# EAGLE design Battery Board V7 (EAGLE 8.5.0)
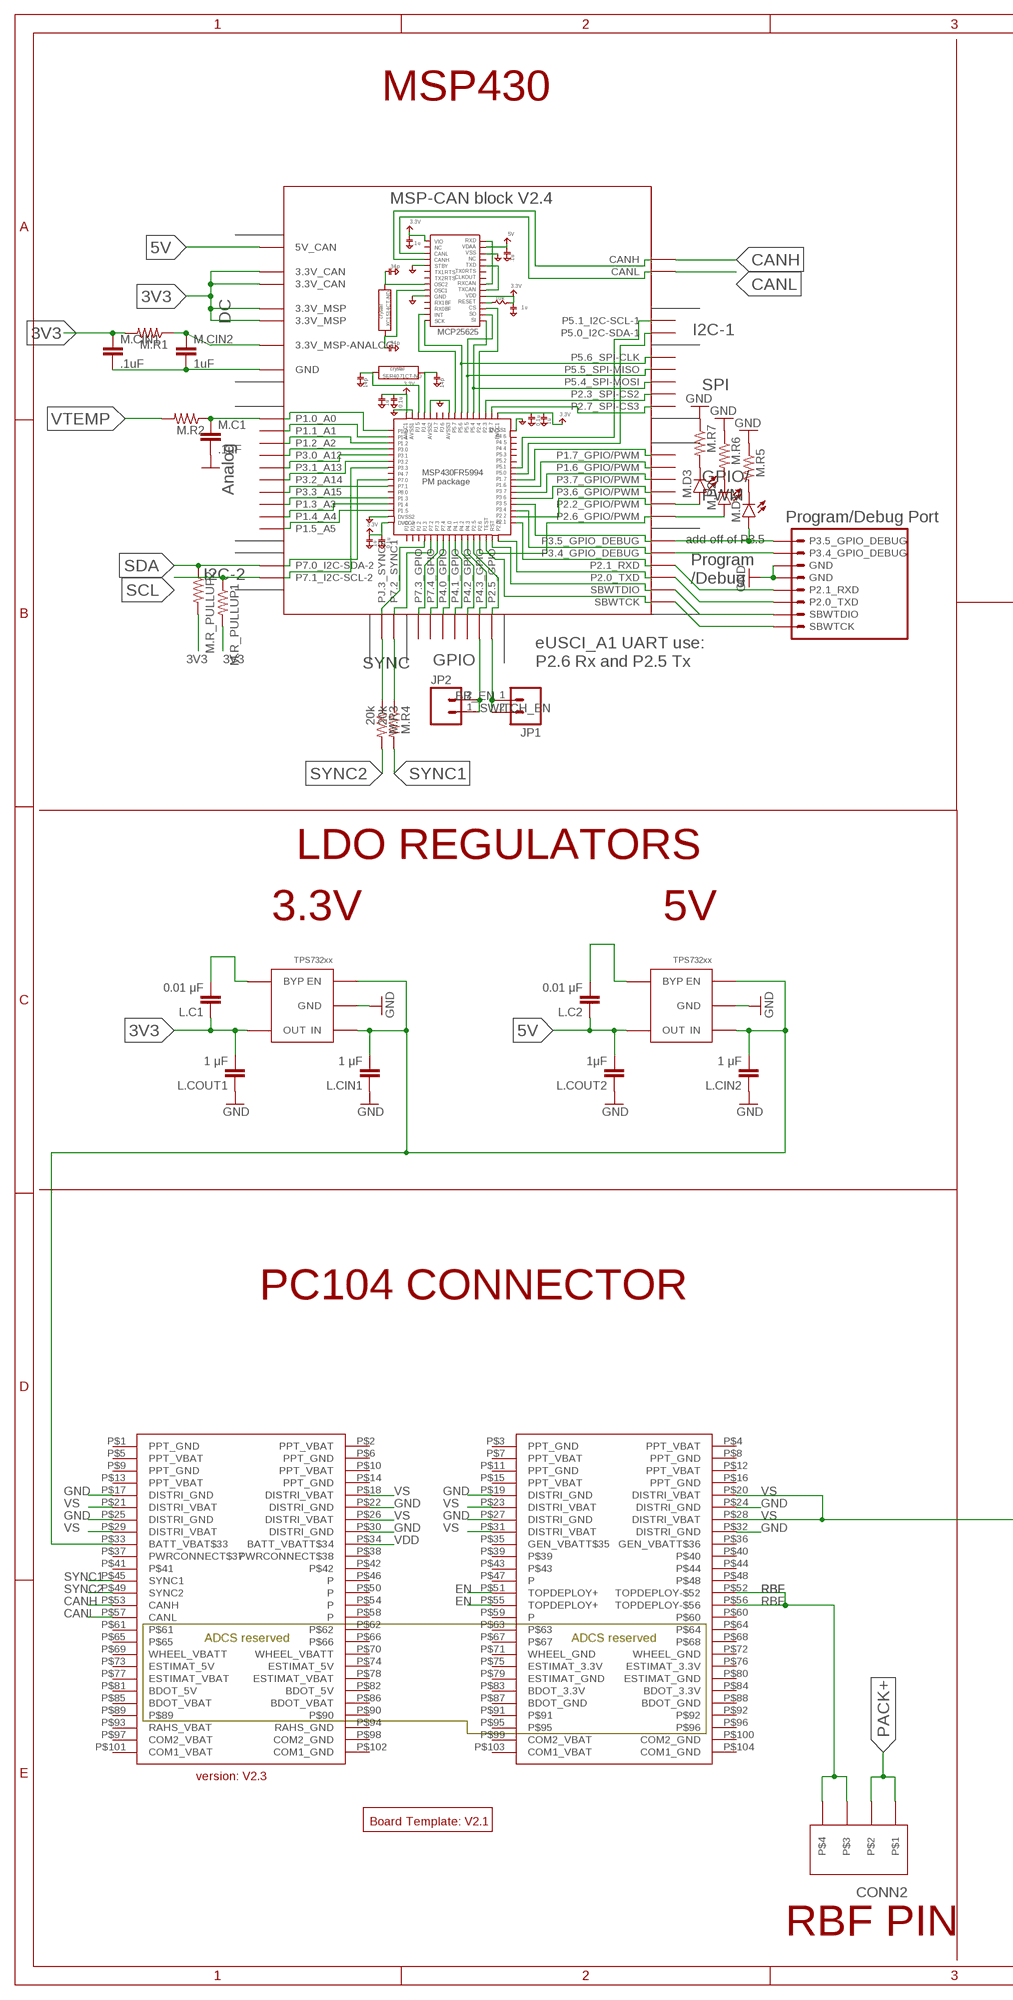
[diagram p0: schematic, sheet 1, part 1 of 2]
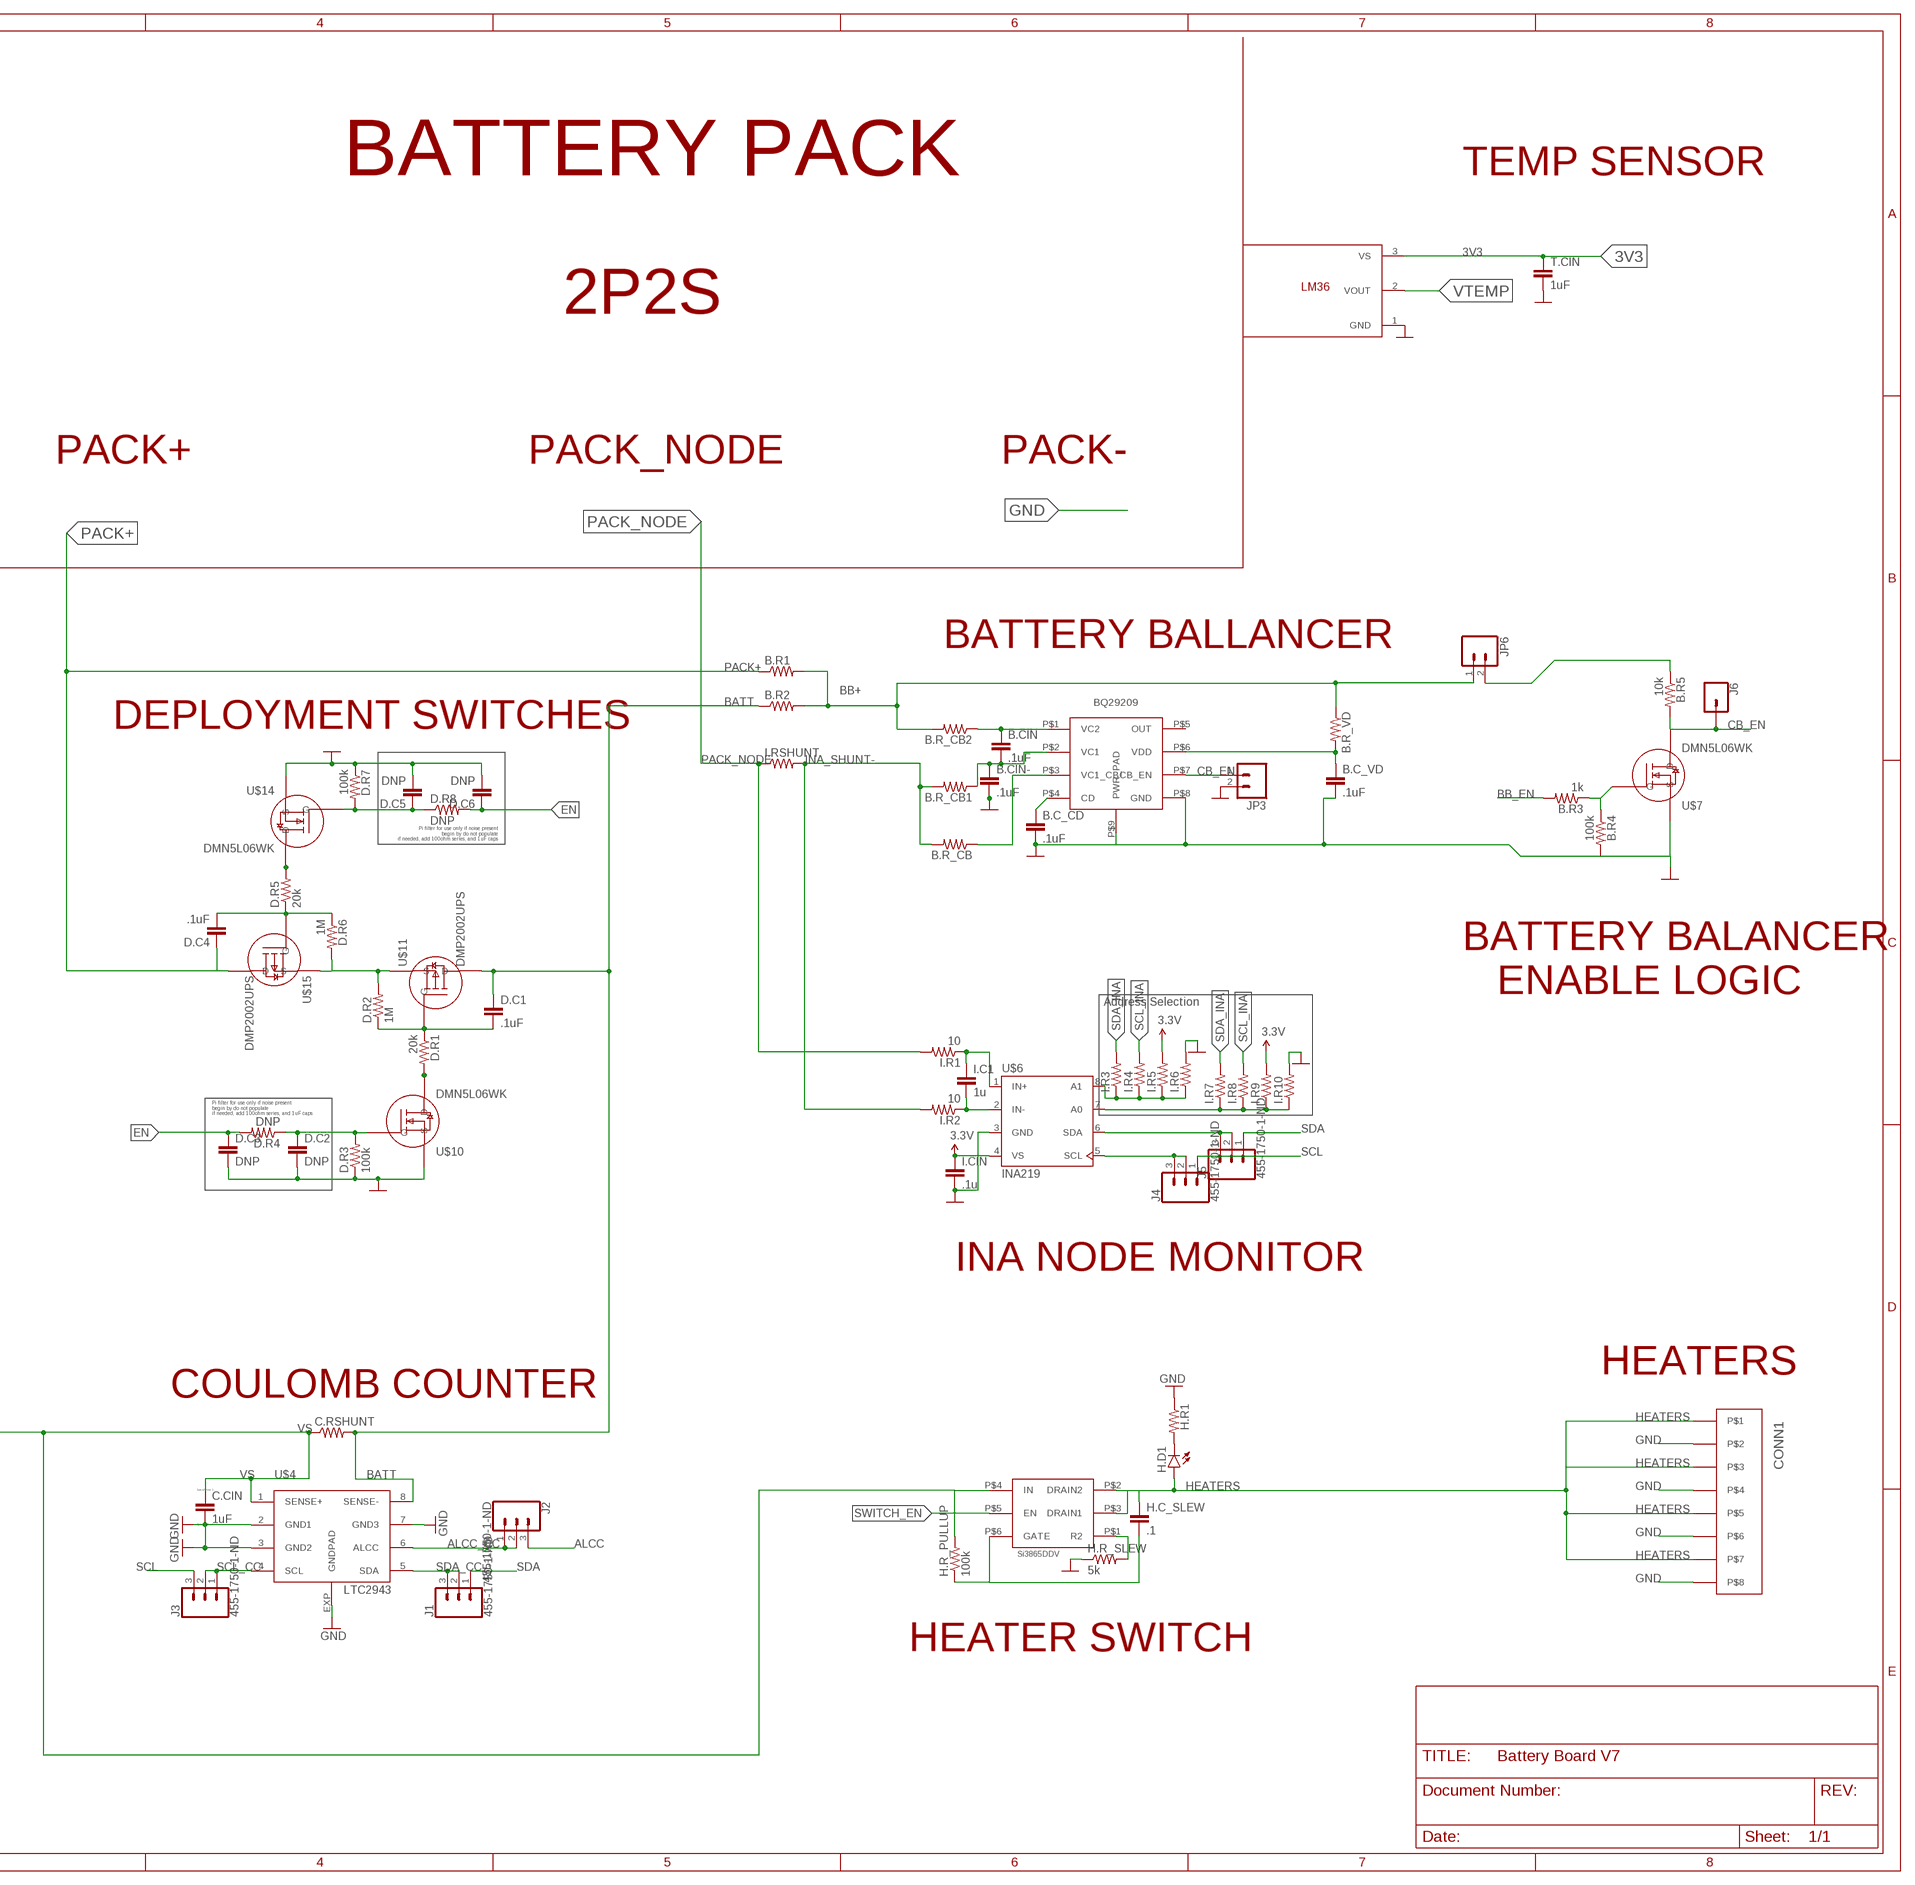
[diagram p1: schematic, sheet 1, part 2 of 2]

## Parts
B.C_CD  .1uF  CAPACITOR0805  [0805]
B.C_VD  .1uF  CAPACITOR0805  [0805]
B.CIN  .1uF  CAPACITOR0805  [0805]
B.CIN-  .1uF  CAPACITOR0805  [0805]
B.R1  RESISTOR0805  [0805]
B.R2  RESISTOR0805  [0805]
B.R3  1k  RESISTOR0805  [0805]
B.R4  100k  RESISTOR0805  [0805]
B.R5  10k  RESISTOR0805  [0805]
B.R_CB  RESISTOR0805  [0805]
B.R_CB1  RESISTOR0805  [0805]
B.R_CB2  RESISTOR0805  [0805]
B.R_VD  RESISTOR0805  [0805]
BLK1  MSP-CAN_BLOCK  [MSP-CAN_BLOCK]
C.CIN  1uF  C  [C0805]
C.RSHUNT  RESISTOR2512  [R2512]
CONN1  PICOLOCK_8  [PICOLOCK_8]
CONN2  PICOLOCK_4  [PICOLOCK_4]
D.C1  .1uF  CAPACITOR0805  [0805]
D.C2  DNP  CAPACITOR0805  [0805]
D.C3  DNP  CAPACITOR0805  [0805]
D.C4  .1uF  CAPACITOR0805  [0805]
D.C5  DNP  CAPACITOR0805  [0805]
D.C6  DNP  CAPACITOR0805  [0805]
D.R1  20k  RESISTOR0805  [0805]
D.R2  1M  RESISTOR0805  [0805]
D.R3  100k  RESISTOR0805  [0805]
D.R4  DNP  RESISTOR0805  [0805]
D.R5  20k  RESISTOR0805  [0805]
D.R6  1M  RESISTOR0805  [0805]
D.R7  100k  RESISTOR0805  [0805]
D.R8  DNP  RESISTOR0805  [0805]
H.C_SLEW  .1  CAPACITOR0805  [0805]
H.D1  LED  [LED-1206]
H.R1  RESISTOR0805  [0805]
H.R_PULLUP  100k  RESISTOR0805  [0805]
H.R_SLEW  5k  RESISTOR0805  [0805]
I.C1  1u  CAPACITOR0805  [0805]
I.CIN  .1u  CAPACITOR0805  [0805]
I.R1  10  RESISTOR0805  [0805]
I.R2  10  RESISTOR0805  [0805]
I.R3  RESISTOR0805  [0805]
I.R4  RESISTOR0805  [0805]
I.R5  RESISTOR0805  [0805]
I.R6  RESISTOR0805  [0805]
I.R7  RESISTOR0805  [0805]
I.R8  RESISTOR0805  [0805]
I.R9  RESISTOR0805  [0805]
I.R10  RESISTOR0805  [0805]
I.RSHUNT  RESISTOR2010  [R2010]
J1  455-1750-1-ND  CONN_03  [1X03]
J2  455-1750-1-ND  CONN_03  [1X03]
J3  455-1750-1-ND  CONN_03  [1X03]
J4  455-1750-1-ND  CONN_03  [1X03]
J5  455-1750-1-ND  CONN_03  [1X03]
J6  CONN_01  [1X01]
JP1  M02LOCK  [1X02_LOCK]
JP2  M02LOCK  [1X02_LOCK]
JP3  M02LOCK  [1X02_LOCK]
JP6  M02LOCK  [1X02_LOCK]
L.C1  0.01 μF  CAPACITOR0805  [0805]
L.C2  0.01 μF  CAPACITOR0805  [0805]
L.CIN1  1 μF  CAPACITOR0805  [0805]
L.CIN2  1 μF  CAPACITOR0805  [0805]
L.COUT1  1 μF  CAPACITOR0805  [0805]
L.COUT2  1μF  CAPACITOR0805  [0805]
M.C1  .1uF  CAPACITOR0805  [0805]
M.CIN1  .1uF  CAPACITOR0805  [0805]
M.CIN2  1uF  CAPACITOR0805  [0805]
M.D1  LED  [LED-1206]
M.D2  LED  [LED-1206]
M.D3  LED  [LED-1206]
M.R1  RESISTOR0805  [0805]
M.R2  RESISTOR0805  [0805]
M.R3  20k  RESISTOR0805  [0805]
M.R4  20k  RESISTOR0805  [0805]
M.R5  RESISTOR0805  [0805]
M.R6  RESISTOR0805  [0805]
M.R7  RESISTOR0805  [0805]
M.R_PULLUP1  RESISTOR0805  [0805]
M.R_PULLUP2  RESISTOR0805  [0805]
T.CIN  1uF  CAPACITOR0805  [0805]
U1  TPS732XX  [SOT-23-5]
U4  TPS732XX  [SOT-23-5]
U$1  BOARD_TEMPLATE1  [BOARD_TEMPLATE]
U$2  PC104_CONNECTOR  [PC104_CONNECTOR]
U$4  LTC2943  [DFN8(3X3)LT]
U$5  BQ29209  [VSON8]
U$6  INA219  [SOT-23-8]
U$7  DMN5L06WK  [SOT-323]
U$8  LM36  [TO-92-3]
U$10  DMN5L06WK  [SOT-323]
U$11  DMP2002UPS  [POWERDI5060-8]
U$12  PROGRAM/DEBUG_PORT  [1X08_CONNECTOR]
U$14  DMN5L06WK  [SOT-323]
U$15  DMP2002UPS  [POWERDI5060-8]
U$16  SI3865DDV  [TSOP-6]

## Nets
3V3: BLK1.3.3V@CAN1(3.3V_CAN) BLK1.3.3V@CAN2(3.3V_CAN) BLK1.3.3V@MSP1(3.3V_MSP) BLK1.3.3V@MSP2(3.3V_MSP) I.CIN.1 I.R5.2 I.R9.2 L.C1.1 L.COUT1.2 M.CIN1.1 M.R1.2 M.R_PULLUP1.2 M.R_PULLUP2.2 T.CIN.1 U1.P$5(OUT) U$6.4(VS) U$8.3(VS) ; supply symbol labelled 3.3V
3V3_MSP-ANALOG: BLK1.3.3V_ANALOG@MSP2(3.3V_MSP-ANALOG) M.CIN2.1 M.R1.1
5V: BLK1.5V(5V_CAN) L.C2.1 L.COUT2.2 U4.P$5(OUT)
ALCC: J2.3
ALCC_CC: J2.1 J2.2 U$4.6(ALCC)
BATT: B.R2.1 C.RSHUNT.2 D.C1.1 U$4.8(SENSE-) U$11.D1(D) U$11.D2(D) U$11.D3(D) U$11.D4(D) U$11.D5(D)
BB+: B.R1.2 B.R2.2 B.R_CB2.2 B.R_VD.1 JP6.1
BB_EN: B.R3.2 BLK1.P4.3_GPIO JP2.1 JP2.2
CANH: BLK1.CANH U$2.P$53(CANH)
CANL: BLK1.CANL U$2.P$57(CANL)
CB_EN: B.R5.2 J6.1 JP3.1 U$5.P$7(CB_EN) U$7.3(D)
EN: D.C3.1 D.C6.1 D.R4.2 D.R8.2 U$2.P$51(TOPDEPLOY+) U$2.P$55(TOPDEPLOY+)
GND: B.C_CD.2 B.C_VD.2 B.CIN-.2 B.R4.2 BLK1.GND@1(GND) BLK1.GND@2(GND) BLK1.GND@3(GND) BLK1.GND@4(GND) BLK1.GND@5(GND) BLK1.GND@7(GND) BLK1.GND@8(GND) BLK1.GND@9(GND) BLK1.GND@10(GND) BLK1.GND@11(GND) BLK1.GND@12(GND) BLK1.GND@13(GND) BLK1.GND@14(GND) BLK1.GND@15(GND) BLK1.GND@16(GND) BLK1.GND@17(GND) BLK1.GND@26(GND) C.CIN.2 CONN1.P$2 CONN1.P$4 CONN1.P$6 CONN1.P$8 D.C2.2 D.C3.2 D.C5.2 D.C6.2 D.R3.1 D.R7.1 H.R1.1 H.R_SLEW.1 I.CIN.2 I.R6.2 I.R10.2 JP3.2 L.CIN1.1 L.CIN2.1 L.COUT1.1 L.COUT2.1 M.C1.2 M.CIN1.2 M.CIN2.2 M.R5.1 M.R6.1 M.R7.1 T.CIN.2 U1.P$2(GND) U4.P$2(GND) U$2.P$17(DISTRI_GND) U$2.P$19(DISTRI_GND) U$2.P$22(DISTRI_GND) U$2.P$24(DISTRI_GND) U$2.P$25(DISTRI_GND) U$2.P$27(DISTRI_GND) U$2.P$30(DISTRI_GND) U$2.P$32(DISTRI_GND) U$4.2(GND1) U$4.3(GND2) U$4.7(GND3) U$4.EXP(GNDPAD) U$5.P$8(GND) U$5.P$9(PWR_PAD) U$6.3(GND) U$7.2(S) U$8.1(GND) U$10.2(S) U$12.5(GND) U$12.6(GND) U$14.2(S) ; supply symbol labelled DGND
HEATERS: CONN1.P$1 CONN1.P$3 CONN1.P$5 CONN1.P$7 H.C_SLEW.1 H.D1.A U$16.P$2(DRAIN2) U$16.P$3(DRAIN1)
IN: D.R2.2 D.R6.2 U$11.S1(S) U$11.S2(S) U$11.S3(S) U$15.S1(S) U$15.S2(S) U$15.S3(S)
INA219_A0_1: I.R7.1 I.R8.1 I.R9.1 I.R10.1 U$6.7(A0)
INA219_A1_1: I.R3.1 I.R4.1 I.R5.1 I.R6.1 U$6.8(A1)
INA219_IN+_1: I.C1.1 I.R1.1 U$6.1(IN+)
INA219_IN-_1: I.C1.2 I.R2.1 U$6.2(IN-)
INA_SHUNT-: B.R_CB1.2 B.R_CB.2 I.R2.2 I.RSHUNT.2
LDO_3V3_BYP1: L.C1.2 U1.P$4(BYP)
LDO_5V_BYP1: L.C2.2 U4.P$4(BYP)
N$1: BLK1.P3.5_GPIO_DEBUG M.D1.A U$12.8(P3.5_GPIO_DEBUG)
N$2: B.R5.1 JP6.2
N$3: BLK1.P3.4_GPIO_DEBUG U$12.7(P3.4_GPIO_DEBUG)
N$4: BLK1.P2.1_RXD U$12.4(P2.1_RXD)
N$5: B.CIN.1 B.R_CB2.1 U$5.P$1(VC2)
N$6: B.CIN-.1 B.CIN.2 B.R_CB1.1 U$5.P$2(VC1)
N$7: D.C1.2 D.R1.1 D.R2.1 U$11.G
N$8: D.C2.1 D.R3.2 D.R4.1 U$10.1(G)
N$9: B.R_CB.1 U$5.P$3(VC1_CB)
N$10: B.C_CD.1 U$5.P$4(CD)
N$11: D.R1.2 U$10.3(D)
N$12: B.R3.1 B.R4.1 U$7.1(G)
N$13: B.C_VD.1 B.R_VD.2 U$5.P$6(VDD)
N$14: D.C4.2 D.R5.1 D.R6.1 U$15.G
N$16: D.C5.1 D.R7.2 D.R8.1 U$14.1(G)
N$17: D.R5.2 U$14.3(D)
N$18: BLK1.P2.0_TXD U$12.3(P2.0_TXD)
N$19: BLK1.SBWTDIO U$12.2(SBWTDIO)
N$20: BLK1.SBWTCK U$12.SBWTCK
N$21: M.D1.C M.R5.2
N$22: BLK1.P1.0_A0 M.C1.1 M.R2.1
N$23: M.D2.C M.R6.2
N$24: M.D3.C M.R7.2
N$25: H.R_SLEW.2 U$16.P$1(R2)
N$26: H.C_SLEW.2 H.R_PULLUP.1 U$16.P$6(GATE)
N$27: BLK1.P2.2_GPIO/PWM M.D3.A
N$28: BLK1.P2.6_GPIO/PWM M.D2.A
N$29: H.D1.C H.R1.2
PACK+: B.R1.1 CONN2.P$1 CONN2.P$2 D.C4.1 U$15.D1(D) U$15.D2(D) U$15.D3(D) U$15.D4(D) U$15.D5(D)
PACK_NODE: I.R1.2 I.RSHUNT.1
RBF: CONN2.P$3 CONN2.P$4 U$2.P$52(TOPDEPLOY-$52) U$2.P$56(TOPDEPLOY-$56)
SCL: BLK1.P7.1_I2C-SCL-2 J3.3 J4.1 M.R_PULLUP1.1
SCL_CC: J3.1 J3.2 U$4.4(SCL)
SCL_INA: I.R4.2 I.R8.2 J4.2 J4.3 U$6.5(SCL)
SDA: BLK1.P7.0_I2C-SDA-2 J1.1 J5.1 M.R_PULLUP2.1
SDA_CC: J1.2 J1.3 U$4.5(SDA)
SDA_INA: I.R3.2 I.R7.2 J5.2 J5.3 U$6.6(SDA)
SWITCH_EN: BLK1.P2.5_GPIO JP1.1 JP1.2 U$16.P$5(EN)
SYNC1: BLK1.P7.2_SYNC1 M.R4.1 M.R4.2 U$2.P$45(SYNC1)
SYNC2: BLK1.PJ.3_SYNC2 M.R3.1 M.R3.2 U$2.P$49(SYNC2)
VDD: L.CIN1.2 L.CIN2.2 U1.P$1(IN) U1.P$3(EN) U4.P$1(IN) U4.P$3(EN) U$2.P$33(BATT_VBAT$33) U$2.P$34(BATT_VBATT$34)
VS: C.CIN.1 C.RSHUNT.1 H.R_PULLUP.2 U$2.P$18(DISTRI_VBAT) U$2.P$20(DISTRI_VBAT) U$2.P$21(DISTRI_VBAT) U$2.P$23(DISTRI_VBAT) U$2.P$26(DISTRI_VBAT) U$2.P$28(DISTRI_VBAT) U$2.P$29(DISTRI_VBAT) U$2.P$31(DISTRI_VBAT) U$4.1(SENSE+) U$16.P$4(IN)
VTEMP: M.R2.2 U$8.2(VOUT)
Unconnected: BLK1.P1.1_A1 BLK1.P1.2_A2 BLK1.P1.3_A3 BLK1.P1.4_A4 BLK1.P1.5_A5 BLK1.P1.6_GPIO/PWM BLK1.P1.7_GPIO/PWM BLK1.P2.4_SPI-CS2(P2.3_SPI-CS2) BLK1.P2.7_SPI-CS3 BLK1.P3.0_A12 BLK1.P3.1_A13 BLK1.P3.2_A14 BLK1.P3.3_A15 BLK1.P3.6_GPIO/PWM BLK1.P3.7_GPIO/PWM BLK1.P4.0_GPIO BLK1.P4.1_GPIO BLK1.P4.2_GPIO BLK1.P5.0_I2C-SDA-1 BLK1.P5.1_I2C-SCL-1 BLK1.P5.4_SPI-MOSI BLK1.P5.5_SPI-MISO BLK1.P5.6_SPI-CLK BLK1.P7.3_GPIO BLK1.P7.4_GPIO U$2.P$1(PPT_GND) U$2.P$2(PPT_VBAT) U$2.P$3(PPT_GND) U$2.P$4(PPT_VBAT) U$2.P$5(PPT_VBAT) U$2.P$6(PPT_GND) U$2.P$7(PPT_VBAT) U$2.P$8(PPT_GND) U$2.P$9(PPT_GND) U$2.P$10(PPT_VBAT) U$2.P$11(PPT_GND) U$2.P$12(PPT_VBAT) U$2.P$13(PPT_VBAT) U$2.P$14(PPT_GND) U$2.P$15(PPT_VBAT) U$2.P$16(PPT_GND) U$2.P$35(GEN_VBATT$35) U$2.P$36(GEN_VBATT$36) U$2.P$37(PWRCONNECT$37) U$2.P$38(PWRCONNECT$38) U$2.P$39 U$2.P$40 U$2.P$41 U$2.P$42 U$2.P$43 U$2.P$44 U$2.P$46(P) U$2.P$47(P) U$2.P$48 U$2.P$50(P) U$2.P$54(P) U$2.P$58(P) U$2.P$59(P) U$2.P$60 U$2.P$61 U$2.P$62 U$2.P$63 U$2.P$64 U$2.P$65 U$2.P$66 U$2.P$67 U$2.P$68 U$2.P$69(WHEEL_VBATT) U$2.P$70(WHEEL_VBATT) U$2.P$71(WHEEL_GND) U$2.P$72(WHEEL_GND) U$2.P$73(ESTIMAT_5V) U$2.P$74(ESTIMAT_5V) U$2.P$75(ESTIMAT_3.3V) U$2.P$76(ESTIMAT_3.3V) U$2.P$77(ESTIMAT_VBAT) U$2.P$78(ESTIMAT_VBAT) U$2.P$79(ESTIMAT_GND) U$2.P$80(ESTIMAT_GND) U$2.P$81(BDOT_5V) U$2.P$82(BDOT_5V) U$2.P$83(BDOT_3.3V) U$2.P$84(BDOT_3.3V) U$2.P$85(BDOT_VBAT) U$2.P$86(BDOT_VBAT) U$2.P$87(BDOT_GND) U$2.P$88(BDOT_GND) U$2.P$89 U$2.P$90 U$2.P$91 U$2.P$92 U$2.P$93(RAHS_VBAT) U$2.P$94(RAHS_GND) U$2.P$95 U$2.P$96 U$2.P$97(COM2_VBAT) U$2.P$98(COM2_GND) U$2.P$99(COM2_VBAT) U$2.P$100(COM2_GND) U$2.P$101(COM1_VBAT) U$2.P$102(COM1_GND) U$2.P$103(COM1_VBAT) U$2.P$104(COM1_GND) U$5.P$5(OUT)

## Notes on the sheet
- MSP430
- BATTERY PACK | TEMP SENSOR
- 2P2S
- PACK+ | PACK_NODE | PACK-
- BATTERY BALLANCER
- DEPLOYMENT SWITCHES
- LDO REGULATORS
- Pi filter for use only if noise present
  begin by do not populate
  if needed, add 100ohm series, and 1uF caps
- 3.3V | 5V
- BATTERY BALANCER
     ENABLE LOGIC
- Address Selection
- Pi filter for use only if noise present
  begin by do not populate
  if needed, add 100ohm series, and 1uF caps
- PC104 CONNECTOR
- INA NODE MONITOR
- HEATERS
- COULOMB COUNTER
- HEATER SWITCH
- RBF PIN

## Library data of the parts
B.C_CD B.C_VD B.CIN B.CIN- D.C1-D.C6 H.C_SLEW I.C1 I.CIN L.C1 L.C2 L.CIN1 L.CIN2 L.COUT1 L.COUT2 M.C1 M.CIN1 M.CIN2 T.CIN = DubSat1 Components:CAPACITOR: Capacitor Standard 0603 ceramic capacitor, and 0.1" leaded capacitor.
B.R1-B.R5 B.R_CB B.R_CB1 B.R_CB2 B.R_VD C.RSHUNT D.R1-D.R8 H.R1 H.R_PULLUP H.R_SLEW I.R1-I.R10 I.RSHUNT M.R1-M.R7 M.R_PULLUP1 M.R_PULLUP2 = DubSat1 Components:RESISTOR: Resistor Basic schematic elements and footprints for 0603, 1206, and PTH resistors.
BLK1 = DubSat1 Components:MSP-CAN_BLOCK
C.CIN = eagle-ltspice:C: CAPACITOR, European symbol; SPICEMODEL: NONE; SPICEPREFIX: C
CONN1 = DubSat1 Components:PICOLOCK_8
CONN2 = DubSat1 Components:PICOLOCK_4
H.D1 M.D1-M.D3 = DubSat1 Components:LED
J1-J5 = SparkFun-Connectors:CONN_03: Multi connection point. Often used as Generic Header-pin footprint for 0.1 inch spaced/style header connections On any of the 0.1 inch spaced packages, you can populate with these: Break Away Headers - Straight <https://www.sparkfun.com/products/116> (PRT-00116) Break Away Male Headers - Right Angle <https://www.sparkfun.com/products/553> (PRT-00553) Female Headers <https://www.sparkfun.com/products/115> (PRT-00115) Break Away Headers - Machine Pin <https://www.sparkfun.com/products/117> (PRT-00117) Break Away Female Headers - Swiss Machine Pin <https://www.sparkfun.com/products/743> (PRT-00743) Stackable Header - 3 Pin (Female, 0.1") <https://www.sparkfun.com/products/13875> (PRT-13875) For SCREWTERMINALS and SPRING TERMINALS visit here: Screw Terimnals on SparkFun.com <https://www.sparkfun.com/search/results?term=Screw+Terminals> (5mm/3.5mm/2.54mm spacing) This device is also useful as a general connection point to wire up your design to another part of your project. Our various solder wires solder well into these plated through hole pads. Hook-Up Wire - Assortment (Stranded, 22 AWG) <https://www.sparkfun.com/products/11375> (PRT-11375) Hook-Up Wire - Assortment (Solid Core, 22 AWG) <https://www.sparkfun.com/products/11367> (PRT-11367) View the entire wire category on our website here <https://www.sparkfun.com/categories/141> Special notes: Molex polarized connector foot print use with SKU : PRT-08232 with associated crimp pins and housings.; PROD_ID: XXX-00000
J6 = SparkFun-Connectors:CONN_01: Single connection point. Often used as Generic Header-pin footprint for 0.1 inch spaced/style header connections On any of the 0.1 inch spaced packages, you can populate with these: Break Away Headers - Straight <https://www.sparkfun.com/products/116> (PRT-00116) Break Away Male Headers - Right Angle <https://www.sparkfun.com/products/553> (PRT-00553) Female Headers <https://www.sparkfun.com/products/115> (PRT-00115) Break Away Headers - Machine Pin <https://www.sparkfun.com/products/117> (PRT-00117) Break Away Female Headers - Swiss Machine Pin <https://www.sparkfun.com/products/743> (PRT-00743) This device is also useful as a general connection point to wire up your design to another part of your project. Our various solder wires solder well into these plated through hole pads. Hook-Up Wire - Assortment (Stranded, 22 AWG) <https://www.sparkfun.com/products/11375> (PRT-11375) Hook-Up Wire - Assortment (Solid Core, 22 AWG) <https://www.sparkfun.com/products/11367> (PRT-11367) View the entire wire category on our website here <https://www.sparkfun.com/categories/141> Special notes: SMTSO-256-ET is a "flush mount" nut for a 4-40 screw. We mostly use this on specialty testbeds; it is a nice way to connect hardware to your PCB at an adjustable hieght. Also note, the SNAP packages are for using a snappable style connector. We sell a baggie of snaps and they are also used on two LilyPad designs: Snap Assortment - 30 pack (male and female) <https://www.sparkfun.com/products/11347> (DEV-11347) LilyPad Arduino SimpleSnap <https://www.sparkfun.com/products/10941> (DEV-10941) LilyPad SimpleSnap Protoboard <https://www.sparkfun.com/products/10940> (DEV-10940)
JP1-JP3 JP6 = SparkFun-Connectors:M02: Standard 2-pin 0.1" header. Use with - straight break away headers ( PRT-00116) - right angle break away headers (PRT-00553) - swiss pins (PRT-00743) - machine pins (PRT-00117) - female headers (PRT-00115) Molex polarized connector foot print use with: PRT-08233 with associated crimp pins and housings. 2.54_SCREWTERM for use with PRT-10571. 3.5mm Screw Terminal footprints for PRT-08084 5mm Screw Terminal footprints for use with PRT-08432
U1 U4 = DubSat1 Components:TPS732XX
U$1 = DubSat1 Components:BOARD_TEMPLATE
U$2 = DubSat1 Components:PC104_CONNECTOR
U$4 = Parts for Power Team1:LTC2943
U$5 = DubSat1 Components:BQ29209
U$6 = DubSat1 Components:INA219
U$7 U$10 U$14 = DubSat1 Components:DMN5L06WK
U$8 = DubSat1 Components:LM36
U$11 U$15 = DubSat1 Components:DMP2002UPS
U$12 = DubSat1 Components:PROGRAM/DEBUG_PORT
U$16 = DubSat1 Components:SI3865DDV

## Board
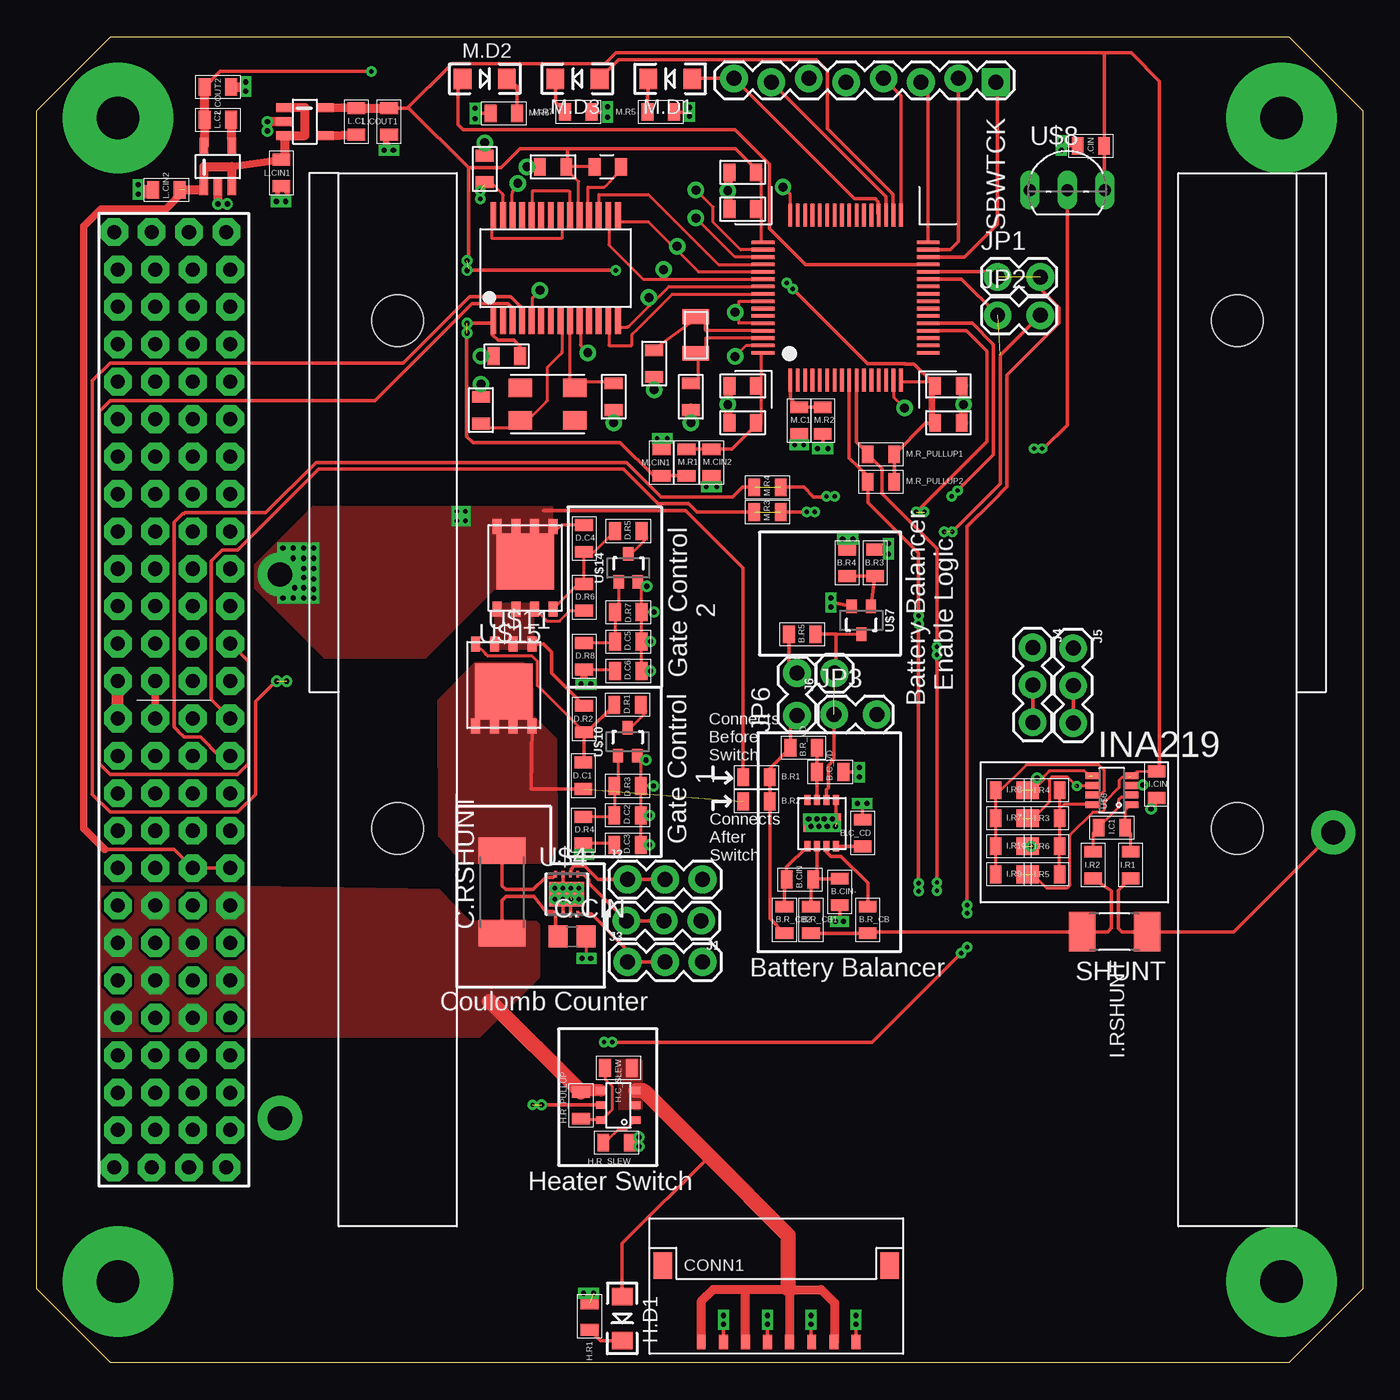
[diagram p2: board, top side]
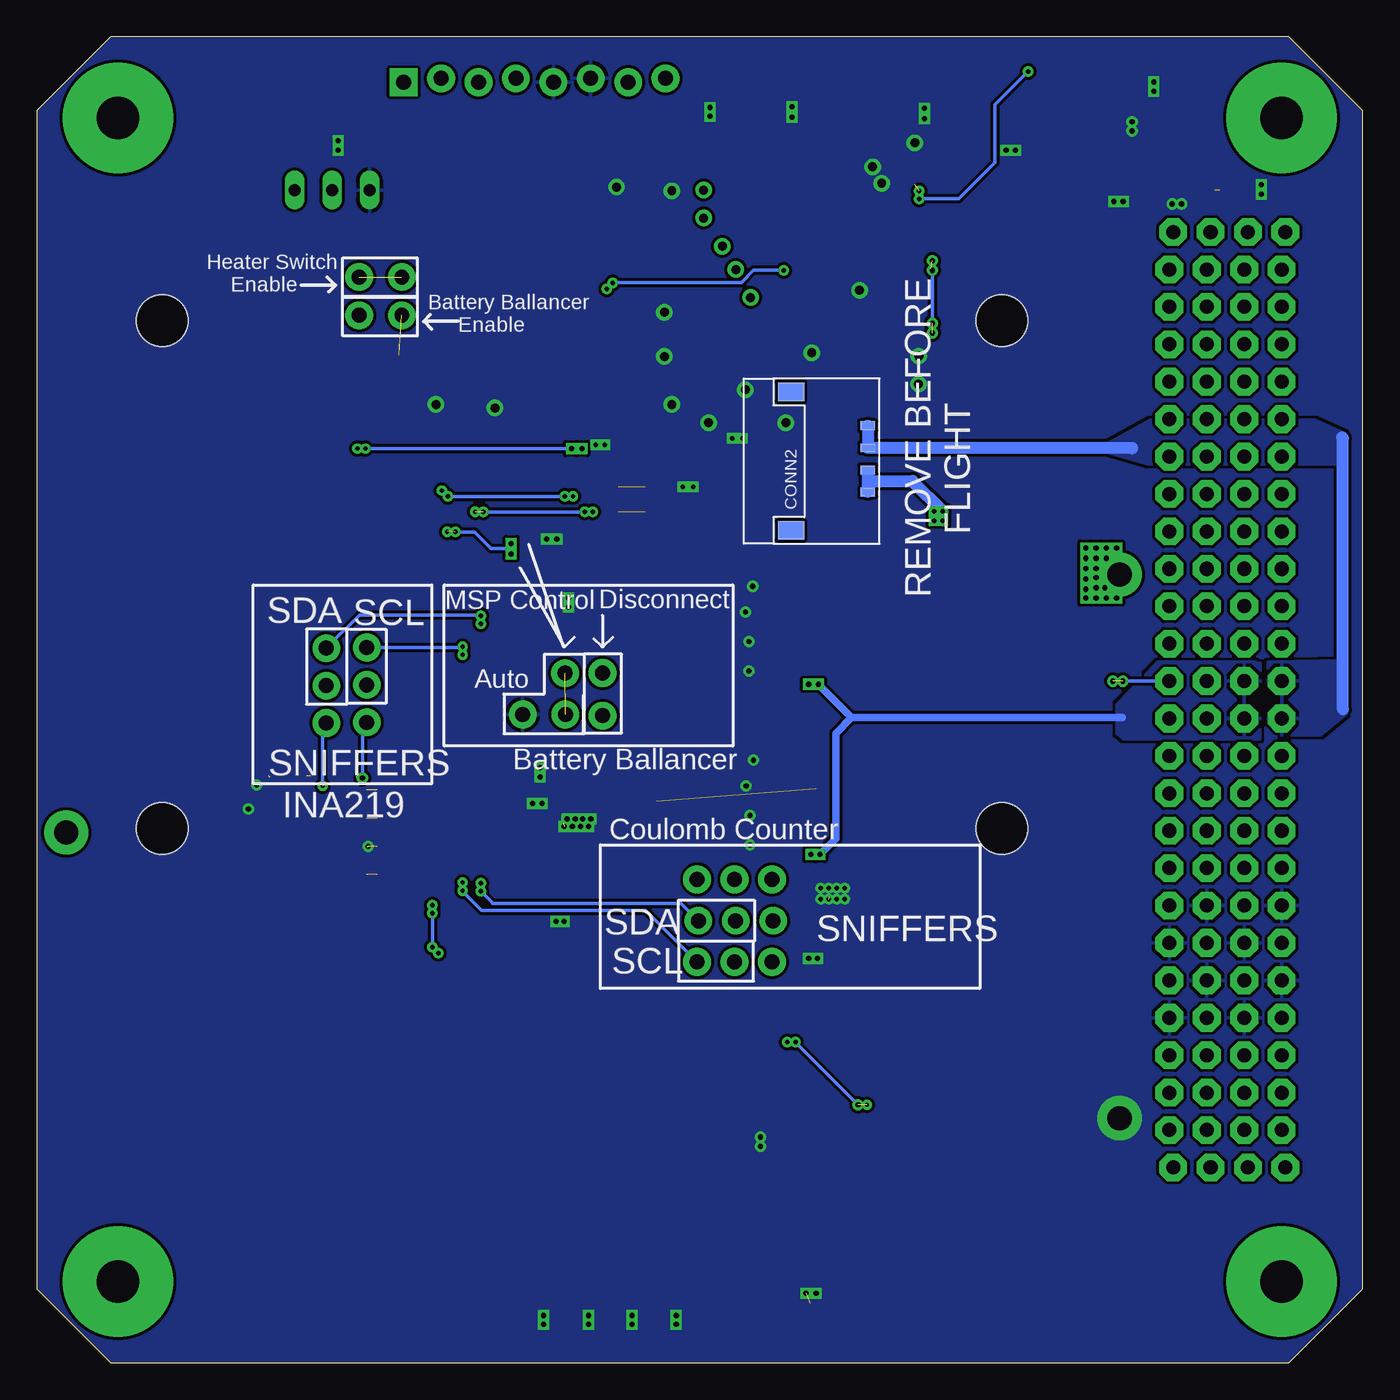
[diagram p3: board, bottom side, seen from below]

Size 90 x 90 mm. Coordinates in mm from the lower left corner, seen from the top.
Copper layers (1*16): Top 0.035mm / dielectric 1.5mm / Bottom 0.035mm
Design rules "default *": minimum track width 8mil, minimum drill 0.3mm, track to track 8mil, track to pad 8mil, pad to pad 8mil, via to via 8mil, smd to smd 0mil, copper to edge 1mil, drill to drill 3mil, minimum pad ring 10mil, minimum via ring 8mil, stop-mask expansion 4mil, vias tented up to drill 0mil, thermal gap 10mil

### Footprints (pad centres in the part's own frame; a part is rotated, then mirrored left to right if it is on the bottom)
0805 = smd 0.8 x 1.2: 1 -0.9,0; 2 0.9,0
MSP-CAN_BLOCK = smd 1.2 x 0.8: 1 -6,6.08; 2 -6,7.88; 3 -8.5,6.08; 4 -8.5,7.88; 9 -8.5,-6.08; 10 -8.5,-7.88; 11 -6,-6.08; 12 -6,-7.88; 13 8.5,6.08; 14 8.5,7.88; 15 6,6.08; 16 6,7.88; 23 8.875,18.955; 24 8.875,20.755; 25 8.875,17.045; 26 8.875,15.245; 27 -3.975,22.105; 28 -3.975,23.905 | smd 1 x 0.25: 3.3V@CAN1 -3.975,22.025; 3.3V@CAN2 8.875,18.875; 3.3V@MSP1 8.501,5.884; 3.3V@MSP2 -8.533,-5.962; 3.3V_ANALOG@MSP2 -8.482,5.904 | smd 0.8 x 1.2: 5 -5.83,10.5; 6 -7.63,10.5; 7 -3.58,13; 8 -5.38,13; 17 -8.545,24.75; 18 -6.745,24.75; 19 -5.83,15.75; 20 -7.63,15.75; 21 7.83,24.5; 22 9.63,24.5 | smd 0.25 x 1: 5V 7.65,24.5 | smd 1.75 x 0.4: CANH -1.6,21.96; CANL -1.6,22.61; P$65 -1.6,23.91; P$66 -1.6,23.26; P$69 -1.6,21.31; P$70 -1.6,20.66; P$71 -1.6,20.01; P$72 -1.6,19.36; P$73 -1.6,18.71; P$74 -1.6,18.06; P$75 -1.6,17.41; P$76 -1.6,16.76; P$77 -1.6,16.11; P$78 -1.6,15.46; P$79 5.6,15.46; P$80 5.6,16.11; P$81 5.6,16.76; P$82 5.6,17.41; P$83 5.6,18.06; P$84 5.6,18.71; P$85 5.6,19.36; P$86 5.6,20.01; P$87 5.6,20.66; P$88 5.6,21.31; P$89 5.6,21.96; P$90 5.6,22.61; P$91 5.6,23.26; P$92 5.6,23.91 | drill 0.61: GND@1 -3.975,24.775; GND@2 -5.875,24.75; GND@3 -3.75,17.5; GND@4 0.5,20.75; GND@5 -8.5,15.75; GND@7 -8.5,10.5; GND@8 -7.25,8; GND@9 -4,7.5; GND@10 -1,7.5; GND@11 7.75,22.25; GND@12 10.5,24.5; GND@13 8.875,21.625; GND@14 7.25,8; GND@15 7.5,4.25; GND@16 -7.5,-4; GND@17 -7.25,-8; GND@26 -6.25,13; P2.4_SPI-CS2 5.397,10.16; P2.7_SPI-CS3 7.303,10.16; P5.4_SPI-MOSI 3.487,11.434; P5.5_SPI-MISO 1.9,12.354; P5.6_SPI-CLK 0,13.348 | smd 1.55 x 0.25: P1.0_A0 -5.6,3.75; P1.1_A1 -5.6,3.25; P1.2_A2 -5.6,2.75; P1.3_A3 -5.6,-1.75; P1.4_A4 -5.6,-2.25; P1.5_A5 -5.6,-2.75; P1.6_GPIO/PWM 5.6,-0.75; P1.7_GPIO/PWM 5.6,-0.25; P2.1_RXD 5.6,-3.75; P2.2_GPIO/PWM 5.6,-3.25; P3.0_A12 -5.6,2.25; P3.1_A13 -5.6,1.75; P3.2_A14 -5.6,1.25; P3.3_A15 -5.6,0.75; P3.4_GPIO_DEBUG 5.6,-2.75; P3.5_GPIO_DEBUG 5.6,-2.25; P3.6_GPIO/PWM 5.6,-1.75; P3.7_GPIO/PWM 5.6,-1.25; P5.0_I2C-SDA-1 5.6,0.25; P5.1_I2C-SCL-1 5.6,0.75; P7.0_I2C-SDA-2 -5.6,-0.25; P7.1_I2C-SCL-2 -5.6,-0.75; P$8 -5.6,0.25; P$11 -5.6,-1.25; P$15 -5.6,-3.25; P$16 -5.6,-3.75; P$43 5.6,1.25; P$44 5.6,1.75; P$45 5.6,2.25; P$46 5.6,2.75; P$47 5.6,3.25; P$48 5.6,3.75 | smd 0.25 x 1.55: P2.0_TXD 3.75,-5.6; P2.5_GPIO 1.75,-5.6; P2.6_GPIO/PWM 2.25,-5.6; P4.0_GPIO -0.25,-5.6; P4.1_GPIO 0.25,-5.6; P4.2_GPIO 0.75,-5.6; P4.3_GPIO 1.25,-5.6; P7.2_SYNC1 -1.75,-5.6; P7.3_GPIO -1.25,-5.6; P7.4_GPIO -0.75,-5.6; P$17 -3.75,-5.6; P$18 -3.25,-5.6; P$19 -2.75,-5.6; P$49 3.75,5.6; P$50 3.25,5.6; P$51 2.75,5.6; P$52 2.25,5.6; P$53 1.75,5.6; P$54 1.25,5.6; P$55 0.75,5.6; P$56 0.25,5.6; P$57 -0.25,5.6; P$58 -0.75,5.6; P$59 -1.25,5.6; P$60 -1.75,5.6; P$61 -2.25,5.6; P$62 -2.75,5.6; P$63 -3.25,5.6; P$64 -3.75,5.6; PJ.3_SYNC2 -2.25,-5.6; SBWTCK 2.75,-5.6; SBWTDIO 3.25,-5.6 | smd 1 x 1.8: P$93 -3.79,10.16; P$94 -1.29,10.16 | smd 1.25 x 1.6: P$104 -6.13,18.38; P$105 -6.13,22.08; P$106 -8.33,22.08; P$107 -8.33,18.38
C0805 = smd 1.3 x 1.5: 1 -0.95,0; 2 0.95,0
R2512 = smd 1.8 x 3.2: 1 -2.8,0; 2 2.8,0
PICOLOCK_8 = smd 1.25 x 1.8: MNT@1 -2.605,5.2; MNT@2 12.805,5.2 | smd 0.6 x 1: P$1 0,0; P$2 1.5,0; P$3 3,0; P$4 4.5,0; P$5 6,0; P$6 7.5,0; P$7 9,0; P$8 10.5,0
PICOLOCK_4 = smd 1.25 x 1.8: MNT@1 -2.605,5.2; MNT@2 6.805,5.2 | smd 0.6 x 1: P$1 0,0; P$2 1.5,0; P$3 3,0; P$4 4.5,0
LED-1206 = smd 1.2 x 1.4: A -1.5,0; C 1.5,0
R2010 = smd 1.8 x 2.7: 1 -2.2,0; 2 2.2,0
1X03 = drill 1.016 pad 1.88: 1 0,0; 2 2.54,0; 3 5.08,0
1X01 = drill 1.016 pad 1.88: 1 0,0
1X02_LOCK = drill 1.016 pad 1.88: 1 -0.178,0; 2 2.718,0
SOT-23-5 = smd 0.6 x 1.2: P$1 -0.95,-1.35; P$2 0,-1.35; P$3 0.95,-1.35; P$4 0.95,1.35; P$5 -0.95,1.35
BOARD_TEMPLATE = drill 2.9 pad 7.5: P$1 -39.5,39.5; P$2 -39.5,-39.5; P$3 39.5,-39.5; P$4 39.5,39.5
PC104_CONNECTOR = drill 0.953 pad 1.88 octagon: P$1 -31.75,32.134; P$2 -31.75,34.674; P$3 -31.75,37.214; P$4 -31.75,39.754; P$5 -29.21,31.88; P$6 -29.21,34.42; P$7 -29.21,36.96; P$8 -29.21,39.5; P$9 -26.67,31.88; P$10 -26.67,34.42; P$11 -26.67,36.96; P$12 -26.67,39.5; P$13 -24.13,31.88; P$14 -24.13,34.42; P$15 -24.13,36.96; P$16 -24.13,39.5; P$17 -21.59,31.88; P$18 -21.59,34.42; P$19 -21.59,36.96; P$20 -21.59,39.5; P$21 -19.05,31.88; P$22 -19.05,34.42; P$23 -19.05,36.96; P$24 -19.05,39.5; P$25 -16.51,31.88; P$26 -16.51,34.42; P$27 -16.51,36.96; P$28 -16.51,39.5; P$29 -13.97,31.88; P$30 -13.97,34.42; P$31 -13.97,36.96; P$32 -13.97,39.5; P$33 -11.43,31.88; P$34 -11.43,34.42; P$35 -11.43,36.96; P$36 -11.43,39.5; P$37 -8.89,31.88; P$38 -8.89,34.42; P$39 -8.89,36.96; P$40 -8.89,39.5; P$41 -6.35,31.88; P$42 -6.35,34.42; P$43 -6.35,36.96; P$44 -6.35,39.5; P$45 -3.81,31.88; P$46 -3.81,34.42; P$47 -3.81,36.96; P$48 -3.81,39.5; P$49 -1.27,31.88; P$50 -1.27,34.42; P$51 -1.27,36.96; P$52 -1.27,39.5; P$53 1.27,31.88; P$54 1.27,34.42; P$55 1.27,36.96; P$56 1.27,39.5; P$57 3.81,31.88; P$58 3.81,34.42; P$59 3.81,36.96; P$60 3.81,39.5; P$61 6.35,31.88; P$62 6.35,34.42; P$63 6.35,36.96; P$64 6.35,39.5; P$65 8.89,31.88; P$66 8.89,34.42; P$67 8.89,36.96; P$68 8.89,39.5; P$69 11.43,31.88; P$70 11.43,34.42; P$71 11.43,36.96; P$72 11.43,39.5; P$73 13.97,31.88; P$74 13.97,34.42; P$75 13.97,36.96; P$76 13.97,39.5; P$77 16.51,31.88; P$78 16.51,34.42; P$79 16.51,36.96; P$80 16.51,39.5; P$81 19.05,31.88; P$82 19.05,34.42; P$83 19.05,36.96; P$84 19.05,39.5; P$85 21.59,31.88; P$86 21.59,34.42; P$87 21.59,36.96; P$88 21.59,39.5; P$89 24.13,31.88; P$90 24.13,34.42; P$91 24.13,36.96; P$92 24.13,39.5; P$93 26.67,31.88; P$94 26.67,34.42; P$95 26.67,36.96; P$96 26.67,39.5; P$97 29.21,31.88; P$98 29.21,34.42; P$99 29.21,36.96; P$100 29.21,39.5; P$101 31.75,32.134; P$102 31.75,34.674; P$103 31.75,37.214; P$104 31.75,39.754
DFN8(3X3)LT = smd 0.25 x 0.45: 1 -2.02,-0.08; 2 -1.52,-0.08; 3 -1.02,-0.08; 4 -0.52,-0.08; 5 -0.52,2.62; 6 -1.02,2.62; 7 -1.52,2.62; 8 -2.02,2.62 | smd 2.38 x 1.65: EXP -1.27,1.27
VSON8 = smd 0.4 x 0.7: P$1 0,0; P$2 0.65,0; P$3 1.3,0; P$4 1.95,0; P$5 0,3.15; P$6 0.65,3.15; P$7 1.3,3.15; P$8 1.95,3.15 | smd 2.54 x 1.27: P$9 1,1.6
SOT-23-8 = smd 0.45 x 1: 1 -0.975,-1.3; 2 -0.325,-1.3; 3 0.325,-1.3; 4 0.975,-1.3; 5 0.975,1.3; 6 0.325,1.3; 7 -0.325,1.3; 8 -0.975,1.3
SOT-323 = smd 0.7 x 0.9: 1 -0.65,-0.95; 2 0.65,-0.95; 3 0,0.95
TO-92-3 = drill 0.813 long: 1 -2.54,0; 2 0,0; 3 2.54,0
BATTERY_HOLDERS = hole 3.5: 28.5,-25.75; 28.5,8.75; -28.5,-25.75; -28.5,8.75
POWERDI5060-8 = smd 3.91 x 3.81: D1 0,0.44 | smd 0.61 x 1.02: D2 -1.905,2.795; D3 -0.635,2.795; D4 0.635,2.795; D5 1.905,2.795; G 1.905,-2.795; S1 -1.905,-2.795; S2 -0.635,-2.795; S3 0.635,-2.795
1X08_CONNECTOR = drill 1.016 pad 1.88: 2 2.54,-0.127; 3 5.08,0.127; 4 7.62,-0.127; 5 10.16,0.127; 6 12.7,-0.127; 7 15.24,0.127; 8 17.78,-0.127 | drill 1.016 pad 1.88 square: SBWTCK 0,0.127
TSOP-6 = smd 0.508 x 0.7: P$1 -1,-1.162; P$2 0,-1.162; P$3 1,-1.162; P$4 1,1.162; P$5 0,1.162; P$6 -1,1.162

### Placement (x,y rotation side)
B.C_CD  56.05,35.95 90 top
B.C_VD  53.85,40.1 0 top
B.CIN  51.8,32.8 0 top
B.CIN-  54.5,31.95 270 top
B.R1  48.85,39.75 0 top
B.R2  48.85,38.1 0 top
B.R3  56.9,54.3 90 top
B.R4  55,54.3 90 top
B.R5  51.95,49.45 0 top
B.R_CB  56.4,30.05 270 top
B.R_CB1  52.55,30.05 270 top
B.R_CB2  50.75,30.05 270 top
B.R_VD  52.05,41.75 0 top
BLK1  54.9,72.3 90 top
C.CIN  36.34,28.93 0 top
C.RSHUNT  31.59,31.94 90 top
CONN1  45.1,1.4 0 top
CONN2  33.6,59.1 90 bottom
D.C1  37.1,39.85 90 top
D.C2  40.1,37.15 0 top
D.C3  40.1,35.15 0 top
D.C4  37.15,55.95 270 top
D.C5  40.15,48.95 0 top
D.C6  40.15,46.95 0 top
D.R1  40.1,44.65 0 top
D.R2  37.15,43.7 90 top
D.R3  40.1,39.15 180 top
D.R4  37.1,36.15 270 top
D.R5  40.15,56.45 0 top
D.R6  37.15,51.95 270 top
D.R7  40.15,50.95 180 top
D.R8  37.15,47.95 270 top
H.C_SLEW  39.48,20.01 180 top
H.D1  39.74,3 270 top
H.R1  37.52,3.14 270 top
H.R_PULLUP  36.94,17.47 90 top
H.R_SLEW  39.35,14.93 180 top
I.C1  72.97,36.32 180 top
I.CIN  76.02,39.24 270 top
I.R1  74.24,33.78 270 top
I.R2  71.7,33.78 270 top
I.R3  68.53,36.95 180 top
I.R4  68.53,38.86 180 top
I.R5  68.53,33.14 180 top
I.R6  68.53,35.05 180 top
I.R7  65.98,36.95 0 top
I.R8  65.98,38.86 0 top
I.R9  65.98,33.14 0 top
I.R10  65.98,35.05 0 top
I.RSHUNT  73.15,29.25 180 top
J1  45.1,30 180 top
J2  40.1,32.8 0 top
J3  40.1,27.2 0 top
J4  67.6,48.55 270 top
J5  70.35,48.5 270 top
J6  54.15,46.8 90 top
JP1  65.4,73.7 0 top
JP2  65.4,71.1 0 top
JP3  54.3,44 0 top
JP6  51.6,44.1 90 top
L.C1  21.69,84.25 270 top
L.C2  12.3,84.37 0 top
L.CIN1  16.61,80.75 90 top
L.CIN2  8.8,79.61 0 top
L.COUT1  23.91,84.25 90 top
L.COUT2  12.3,86.59 180 top
M.C1  51.75,63.95 270 top
M.CIN1  42.4,61.1 90 top
M.CIN2  45.8,61.1 270 top
M.D1  43,87.15 180 top
M.D2  30.4,87.15 0 top
M.D3  36.7,87.15 180 top
M.R1  44.1,61.1 270 top
M.R2  53.35,63.95 270 top
M.R3  49.6,57.74 0 top
M.R4  49.6,59.42 0 top
M.R5  42.35,84.9 180 top
M.R6  31.7,84.8 0 top
M.R7  36.75,84.9 180 top
M.R_PULLUP1  57.3,61.65 0 top
M.R_PULLUP2  57.3,59.8 0 top
T.CIN  71.55,82.6 180 top
U1  18.2,84.25 270 top
U4  12.3,81.19 0 top
U$1  45,45 90 top
U$2  45,45 90 top
U$4  37.24,30.53 0 top
U$5  52.3,35.05 0 top
U$6  72.97,38.86 90 top
U$7  55.97,50.39 180 top
U$8  69.95,79.6 0 top
U$9  [BATTERY_HOLDERS]  53,45 180 top
U$10  40.1,42.15 0 top
U$11  31.7,46 180 top
U$12  65.1,87.05 180 top
U$14  40.15,53.95 0 top
U$15  33.15,53.95 0 top
U$16  39.48,17.47 90 top

### Tracks (layer width: path | path; a pad name or v marks a point on that pad's centre or on a via)
3V3  (via drill 0.3, 0.35)  (4 unrouted)
  Top 0.203: I.CIN.1 74.65,40.11 U$6.4 | 67.86,32.91 68.53,32.24 69.95,32.24 70.13,32.42 70.13,35.81 71.67,37.36 72.3,37.36 72.47,37.53 72.47,38.04 73.47,39.03 73.47,39.54 73.64,39.72 74.15,39.72
  Top 0.254: M.R1.2 M.CIN1.1 41.85,60.2 39.6,62.45 29.6,62.45 29.18,62.88 29.18,70.55 v29.2,70.55 30.9,70.55 30.9,69.8 31.3,69.4 32.4,69.4 32.85,68.95 32.85,68.35 BLK1.3.3V@CAN1 | M.R_PULLUP2.2 M.R_PULLUP1.2 60.32,63.77 BLK1.3.3V@MSP2 60.86,66.49 59.55,67.8 58.92,67.8 58.91,67.81 56.39,67.81 v51.3,72.9 v50.9,73.3 | I.R5.2 67.86,32.91 | L.COUT1.2 25.15,85.15 | 25.15,85.15 25.25,85.15 29.3,81.1 | 29.3,81.1 31.5,81.1 32.8,82.4 36.05,82.4 | BLK1.3.3V@MSP1 47.42,82.4 36.05,82.4 | BLK1.3.3V@CAN2 36.02,82.38 36.05,82.4 | 25.15,85.15 27.97,87.97 27.97,87.99 28.16,88.18 38.58,88.18 39.31,88.9 72.4,88.9 | U$8.3 72.45,79.64 T.CIN.1 72.45,88.85 72.4,88.9 | 29.18,74.15 v29.2,74.15 | v29.2,74.15 v39.3,74.15 | 76,40.16 I.CIN.1 76.2,40.32 76.2,87 74.3,88.9 72.4,88.9 | 29.3,81.1 29.3,74.25 v29.2,74.15
  Top 0.61: U1.P$5 L.C1.1 L.COUT1.2
  Bottom 0.254: v39.3,74.15 41.34,74.15 42.18,73.31 50.69,73.31 50.7,73.3 v50.9,73.3 | v29.2,74.15 v29.2,70.55
  other vias: 29.2,74.8 29.2,69.9
3V3_MSP-ANALOG
  Top 0.254: BLK1.3.3V_ANALOG@MSP2 47.18,62 M.CIN2.1 M.R1.1
5V  (via drill 0.3)  (1 unrouted)
  Top 0.254: L.COUT2.2 12.45,87.65 v22.7,87.65
  Top 0.61: U4.P$5 L.C2.1 L.COUT2.2 11.34,86.59
  Bottom 0.254: v22.7,87.65 24.95,85.4 24.95,81.45 27.4,79 v30.1,79 v30.1,79.55
ALCC_CC
  Top 0.254: 40.35,32.8 J2.1 | 40.35,32.8 J2.2 | U$4.6 36.26,33.19 36.26,33.49 36.48,33.7 37.19,33.7 38.1,32.8 40.35,32.8
BATT  (1 unrouted)
  Top 0.254: U$4.8 35.02,32.95 34.54,32.95 33.7,32.11 31.85,32.11 31.59,32.37 C.RSHUNT.2 | D.C1.1 33.55,38.95 U$11.D2
  pour Top (no thermals): 29.8,47.45 27.3,44.95 27.35,35.8 28.95,34 34.6,34 35.25,35 35.2,42.3 33.6,43.9 33.6,46.85 33,47.45
  pour Top (no thermals): 33.45,44 33.45,42 29.95,42 29.95,44
BB+
  Top 0.203: JP6.1 51.15,43.47
  Top 0.254: 51.15,43.47 B.R_VD.1 | B.R_VD.1 51.15,41.4 | B.R_VD.1 49.75,40.35 B.R1.2 B.R2.2 49.75,30.15 B.R_CB2.2
BB_EN  (via drill 0.3, 0.35)  (2 unrouted)
  Top 0.254: v62.15,56.4 62.15,56.45 62.2,56.45 65.38,59.64 65.4,59.67 65.4,68.38 JP2.2 | BLK1.P4.3_GPIO 62.77,73.55 JP2.1 | B.R3.2 57.4,55.2 v57.8,55.6
  Bottom 0.254: v62.15,56.4 60.3,56.4 59.15,55.25 58.15,55.25 | 58.15,55.25 v57.8,54.9 | 58.15,55.25 v57.8,55.6
  other vias: 61.6,56.4
CANH  (via drill 0.35)  (1 unrouted)
  Top 0.254: v16.29,46.26 16.27,46.28 16.26,46.28 14.85,44.87 14.85,38.58 13.65,37.38 4.97,37.38 3.77,38.58 3.77,66.66 4.97,67.86 24.86,67.86 29.36,72.36 32.17,72.36 32.62,71.91 32.63,71.91 32.94,71.59 BLK1.CANH
  Bottom 0.254: v16.29,46.26 U$2.P$53
  other vias: 16.95,46.26
CANL
  Top 0.254: BLK1.CANL 32.29,71.59 31.98,71.91 29.55,71.91 22.97,65.32 4.97,65.32 4.23,64.58 4.23,40.66 4.97,39.92 13.65,39.92 14.39,40.66 14.39,47.59 13.17,48.81 U$2.P$57
CB_EN  (1 unrouted)
  Top 0.254: JP3.1 54.12,40.94 53.72,40.54 53.72,39.02 53.6,38.9 U$5.P$7 | 54.25,49.45 U$7.3 | 54.25,49.45 54.25,46.9 J6.1 | B.R5.2 54.25,49.45
EN  (via drill 0.35)
  Top 0.203: D.C3.1 39.1,35.25 D.R4.2 | D.C6.1 39.15,47.05 D.R8.2
  Top 0.508: v37.6,46.05 v36.95,46.05 arc90 37.15,46.25 D.R8.2 | D.R4.2 arc90 36.85,35 v36.85,34.5 v37.45,34.5 | U$2.P$55 U$2.P$51
  Bottom 0.508: v36.85,34.5 35.75,35.6 35.75,42.7 34.7,43.8 | 34.7,43.8 16.3,43.8 | v36.95,46.05 34.7,43.8
  pour Bottom: 6.95,47.5 6.99,42.29 16.23,42.29 16.7,42.7 16.7,44.7 13.91,47.59 7.26,47.59 7.3,47.5
GND  (via drill 0.3, 0.35, 1.63 pad 3)  (5 unrouted)
  Top 0.203: U$6.3 75.2,39.19 v75.08,39.22 | I.CIN.2 76.02,37.97 v75.64,37.59 | v41.6,35.15 D.C3.2 D.C2.2 | v41.6,37.15 D.C2.2 | v41.85,39.15 D.R3.1 | v41.35,40.9 41.05,41.2 U$10.2 41,40.95 D.R3.1 | D.C2.2 D.R3.1 | v41.65,46.95 D.C6.2 D.C5.2 | v41.65,48.95 D.C5.2 | v41.9,50.95 D.R7.1 | v41.4,52.7 41.1,53 U$14.2 41.05,52.75 D.R7.1 | D.C5.2 D.R7.1 | C.CIN.2 37.29,27.49 37.25,27.45 | v40.88,14.68 H.R_SLEW.1
  Top 0.254: v37,27.45 37.25,27.45 v37.6,27.45 | U$5.P$8 54.25,36.65 U$5.P$9 | B.CIN-.2 54.5,30.25 v54.2,29.95 v54.75,29.95 | v55.7,37.95 v56.35,37.95 arc90 56.05,37.65 B.C_CD.2 | B.C_VD.2 55.85,40.1 v55.85,39.75 v55.85,40.4 | U$7.2 54.25,51.55 v53.9,51.9 v53.9,51.3 | v46.6,2.6 CONN1.P$2 | v49.6,2.6 CONN1.P$4 | v52.55,2.6 52.55,1.45 CONN1.P$6 | v55.6,2.6 CONN1.P$8 | M.R5.1 44.3,84.9 | v44.3,84.6 44.3,84.9 | v44.3,85.2 44.3,84.9 | M.R6.1 30.1,84.8 v29.75,85.15 v29.75,84.45 | M.R7.1 38.4,84.9 v38.75,85.25 v38.75,84.55 | U$4.7 35.72,32.05 35.86,31.91 | 35.86,31.91 U$4.EXP 36.22,31.6 U$4.3 | U$4.2 35.72,31.77 35.86,31.91 | T.CIN.2 69.9,82.6 arc-90 v69.55,82.95 v69.55,82.3 | v42.8,62.75 v42.1,62.75 42.4,62.45 M.CIN1.2 | 45.85,59.75 v46.15,59.45 v45.45,59.45 45.47,59.47 45.85,59.47 45.8,59.52 M.CIN2.2 | M.C1.2 51.75,62.6 v51.45,62.3 v52.05,62.3 | B.R4.2 55,55.6 v54.7,55.9
  Top 0.305: v23.57,82.31 23.69,83.08 23.75,83.14 | 23.75,83.14 L.COUT1.1 | v24.2,82.31 23.75,82.89 23.75,83.14 | v16.26,78.82 16.39,79.59 L.CIN1.1 17.02,79.39 v16.9,78.82
  Top 0.61: U1.P$2 v15.66,84.25 v15.66,83.61 | U4.P$2 v12.3,78.66 v12.93,78.66 | v14.18,86.3 13.89,86.59 L.COUT2.1 13.83,86.59 v14.18,86.94 | v6.87,79.32 7.56,79.32 L.CIN2.1 7.22,79.61 v6.87,79.95
  other vias: 67.51,35.05 52.55,36.4 52.4,36.9 53.1,36.4 52.95,36.9 53.65,36.4 53.45,36.9 54,36.9 54.2,36.4 40.88,15.31 46.6,3.2 49.6,3.2 52.55,3.2 55.6,3.2 35.15,32.2 35.7,32.2 36.25,32.2 36.8,32.2 35.15,31.45 35.7,31.45 36.25,31.45 36.8,31.45 16.5,16.6 37.8,4.7 37.1,4.7 55.4,55.9
  pour Bottom (rank 2): -0.25,90.3 89.4,90.3 90,90.9 90,0.05 -0.45,0.05 -0.45,89 -0.15,89
HEATERS
  Top 0.254: 45.65,14 39.74,8.09 H.D1.A
  Top 0.61: 51.2,4.95 53.25,4.95 54.15,4.05 54.15,1.45 CONN1.P$7 | 51.2,4.95 51.1,4.85 CONN1.P$5 | 47.95,4.95 51.1,4.95 51.2,4.95 | 47.95,4.95 45.9,4.95 45.1,4.15 CONN1.P$1 | CONN1.P$3 48.1,4.8 47.95,4.95
  Top 1.016: U$16.P$3 41.18,18.47 45.65,14 51,8.65 51,5.05 51.1,4.95
  pour Top (isolate 0.305, no thermals): 39.48,17.22 39.48,20.52 41,20.52 41,17.22
IN
  Top 0.203: U$15.S3 33.81,51.16 34.62,50.34 35.49,50.34 36.2,51.05 D.R6.2
  Top 0.254: D.R2.2 34.95,46.8 34.95,48.25 34.41,48.8 U$11.S1
  pour Top (no thermals): 33.7,48.5 33.7,50.5 31.2,50.5 31.2,48.5
  pour Top (no thermals): 31.15,51.45 31.15,49.45 33.65,49.45 33.65,51.45
INA219_A0_1
  Top 0.203: U$6.7 71.79,38.66 72.3,38.66 72.47,38.83 72.47,40.19 72.08,40.58 67.17,40.58 65.09,38.49 | 65.09,38.49 I.R7.1 I.R10.1 I.R9.1 | 65.09,38.49 I.R8.1
INA219_A1_1
  Top 0.203: I.R5.1 I.R6.1 I.R3.1 69.42,37.59 | I.R4.1 69.42,37.59 | U$6.8 69.72,37.88 69.42,37.59
INA219_IN+_1
  Top 0.203: U$6.1 73.87,37.48 I.C1.1 74.24,35.95 I.R1.1
INA219_IN-_1
  Top 0.203: 72.34,36.32 I.C1.2 | I.C1.2 71.7,35.95 I.R2.1 | I.C1.2 73.47,37.72 73.47,38.24 73.64,38.41 74.15,38.41 U$6.2
INA_SHUNT-
  Top 0.254: B.R_CB1.2 B.R_CB.2 56.5,29.25 I.RSHUNT.2 | 70.7,29 I.RSHUNT.2 | I.RSHUNT.2 72.7,29.25 72.95,29.5 72.95,32.03 I.R2.2
LDO_3V3_BYP1
  Top 0.61: U1.P$4 L.C1.2
LDO_5V_BYP1
  Top 0.61: U4.P$4 L.C2.2
N$1
  Top 0.254: BLK1.P3.5_GPIO_DEBUG 57.11,77.94 57.11,78.81 56.91,79 55.49,79 U$12.8 44.53,87.18 M.D1.A
N$2
  Top 0.254: B.R5.1 51.05,47.37 JP6.2
N$3
  Top 0.254: U$12.7 57.65,79.13 BLK1.P3.4_GPIO_DEBUG
N$4
  Top 0.254: BLK1.P2.1_RXD 58.65,86.01 U$12.4
N$5
  Top 0.254: B.R_CB2.1 50.75,32.65 B.CIN.1 50.9,33.65 U$5.P$1
N$6
  Top 0.254: B.R_CB1.1 52.55,32.65 B.CIN.2 | B.CIN.2 arc90 52.95,33.05 U$5.P$2 | B.CIN.2 arc-90 52.75,32.85 B.CIN-.1
N$7
  Top 0.203: U$11.G 30.43,48.16 30.43,48.15 30.62,47.95 33.63,47.95 33.98,47.6 33.98,45.97 D.R2.1
  Top 0.254: D.C1.2 37.15,40.8 D.R2.1 37.35,42.8 D.R1.1
N$8
  Top 0.203: U$10.1 39.45,39.4 D.R3.2 D.C2.1 39.1,37.05 D.R4.1
N$9
  Top 0.254: B.R_CB.1 56.4,32.56 54.59,34.37 53.91,34.37 53.6,34.68 U$5.P$3
N$10
  Top 0.254: U$5.P$4 B.C_CD.1
N$11
  Top 0.203: U$10.3 40.3,43.1 41.35,44.15 41.35,44.3 D.R1.2
N$12
  Top 0.254: U$7.1 B.R3.1 B.R4.1
N$13
  Top 0.254: B.R_VD.2 B.C_VD.1 U$5.P$6
N$14
  Top 0.2: D.R6.1 D.C4.2
  Top 0.203: U$15.G 36.75,52.85 D.R6.1 | D.C4.2 37.85,55.05 D.R5.1
N$16
  Top 0.203: U$14.1 39.5,51.2 D.R7.2 D.C5.1 39.15,48.85 D.R8.1
N$17
  Top 0.203: U$14.3 40.35,54.9 41.4,55.95 41.4,56.1 D.R5.2
N$18
  Top 0.254: BLK1.P2.0_TXD 60.5,86.44 U$12.3
N$19
  Top 0.254: BLK1.SBWTDIO 62,75.55 62.55,76.1 62.55,87.17 U$12.2
N$20
  Top 0.254: BLK1.SBWTCK 62.95,75.05 65.2,77.3 65.2,86.82 U$12.SBWTCK
N$21
  Top 0.254: M.D1.C M.R5.2
N$22
  Top 0.254: BLK1.P1.0_A0 51.15,65.45 M.C1.1 M.R2.1
N$23
  Top 0.254: M.D2.C 32.6,86.65 M.R6.2
N$24
  Top 0.254: M.D3.C 35.2,85.55 M.R7.2
N$25
  Top 0.203: U$16.P$1 40.01,15.84 39.47,15.84 38.82,15.18 H.R_SLEW.2
N$26
  Top 0.203: H.C_SLEW.2 38.58,19.24 39.03,18.79 39.03,17.15 38.79,16.91 38.76,16.91 U$16.P$6 37.04,16.47 H.R_PULLUP.1
N$27
  Top 0.254: BLK1.P2.2_GPIO/PWM 58.11,77.94 58.11,79.32 53.67,83.76 53.67,87.7 52.93,88.45 39.5,88.45 M.D3.A
N$28
  Top 0.254: BLK1.P2.6_GPIO/PWM 52.17,74.55 49.73,76.98 49.73,81.35 47.4,83.69 29.96,83.69 29.95,83.7 28.95,83.7 28.6,84.05 28.6,86.85 M.D2.A
N$29
  Top 0.254: H.D1.C 38.26,1.5 H.R1.2
PACK+  (via drill 0.3, 0.35, 1.63 pad 3)
  Top 0.2: D.C4.1 35.61,56.85 U$15.D1
  Top 0.254: B.R1.1 47.95,53.95 44.05,57.85 34.4,57.85
  Bottom 0.406: CONN2.P$2 33.6,60.4 33.6,59.85 CONN2.P$1
  Bottom 0.61: CONN2.P$2 33.6,60.4
  Bottom 0.813: 33.6,59.85 30.55,59.85 v28.5,57.8 | CONN2.P$1 33.6,60.4
  other vias: 16.5,53.5 29.1,57.8 28.5,57.15 29.1,57.15 16.7,55.3 17.4,55.3 18.1,55.3 18.8,55.3 17.4,54.6 18.1,54.6 18.8,54.6 18.1,53.9 18.8,53.9 18.1,53.3 18.8,53.2 17.5,52.6 18.1,52.6 18.8,52.5 16.7,51.9 17.4,51.9 18.1,51.9 18.8,51.9
  pour Top (no thermals): 31.4,55.95 31.4,57.95 34.9,57.95 34.9,55.95
  pour Top (no thermals): 18.75,58.05 34.95,58.05 34.95,52.6 31.05,52.6 26.35,47.9 19.55,47.9 14.85,52.6 14.85,54.15
PACK_NODE  (via drill 1.63 pad 3)
  Top 0.254: I.R1.2 73.41,32.05 73.41,29.49 73.65,29.25 I.RSHUNT.1 81.25,29.25 v88,36
RBF
  Top 0.813: U$2.P$52 U$2.P$56
  Bottom 0.406: 33.6,62.2 CONN2.P$3
  Bottom 0.813: CONN2.P$4 33.6,62.2 | CONN2.P$3 15.7,62.1 arc90 15.65,62.05 | 1.35,44.35 1.35,62.75 1.4,62.8
  pour Bottom: 6.4,47.55 1.1,47.65 1.1,44.05 2.85,42.6 6.4,42.6
  pour Bottom: 1.15,63.05 3.25,64 14.4,64 17.35,62.35 17.35,61.8 14.55,61 1.35,61 1.15,58.4
SCL  (via drill 0.3)
  Top 0.254: BLK1.P7.1_I2C-SCL-2 55.65,62.5 56.4,61.75 M.R_PULLUP1.1 57.35,60.7 57.35,59 61.1,55.25 v61.1,48.6 v61.1,48.05 v61.1,32.6 v61.1,32.05
  Bottom 0.254: J3.3 48.68,30.7 59.8,30.7 61,31.9 v61.1,32.05 | J4.1 61.1,48.55 v61.1,48.6
SCL_CC
  Top 0.254: J3.2 J3.1 40.1,28 37.65,30.45 U$4.4
SCL_INA  (via drill 0.35)  (3 unrouted)
  Top 0.203: I.R4.2 68.31,39.55 68.31,39.76 68.73,40.17 71.09,40.17 71.43,39.84
  Top 0.254: J4.3 J4.2 | 68.29,39.76 68.29,39.73 68.26,39.7 v67.9,39.7
  Bottom 0.254: v67.9,39.7 67.9,43.17 J4.3
SDA  (via drill 0.3)
  Top 0.254: BLK1.P7.0_I2C-SDA-2 55.14,66.66 55.14,61.39 56.4,60.18 M.R_PULLUP2.1 56.4,58.4 59.85,54.95 v59.85,50.7 v59.85,50.15 v59.85,32.55 v59.85,32
  Bottom 0.254: J1.1 46.26,31.16 59.05,31.16 59.05,31.2 v59.85,32 | J5.1 68.1,50.75 59.85,50.75 v59.85,50.7
SDA_CC
  Top 0.254: J1.2 J1.3 37.49,32.53 37.49,32.76 37.1,33.15 U$4.5
SDA_INA  (via drill 0.3)  (2 unrouted)
  Top 0.203: I.R3.2 68.72,38.05 68.72,39.59 68.9,39.77 69.95,39.77 70.53,39.19 U$6.6
  Top 0.254: J5.3 J5.2
  Bottom 0.254: v70.6,39.15 70.6,43.17 J5.3
SWITCH_EN  (via drill 0.3, 0.35)  (2 unrouted)
  Top 0.254: v63.15,28.2 v62.75,27.8 56.7,21.75 v39.05,21.75 v38.5,21.75 | v63.15,30.5 v63.15,31.05 63.15,56.75 64.82,58.43 65.86,59.46 65.86,67.04 69.39,70.57 69.39,71.63 68.12,72.9 JP1.2 | BLK1.P2.5_GPIO 64.87,74.05 JP1.1 | v34.25,17.5 38.29,17.5 U$16.P$5
  Bottom 0.254: v34.25,17.5 v38.5,21.75 | v63.15,28.2 v63.15,30.5
  other vias: 33.65,17.5
SYNC1  (via drill 0.3)  (1 unrouted)
  Top 0.254: U$2.P$45 12.38,41.19 11.11,42.46 9.99,42.46 9.6,42.85 9.6,42.86 9.31,43.15 9.31,57.06 9.9,57.65 10,57.65 10.05,57.7 15.54,57.7 18.95,61.11 40.03,61.11 42.37,58.77 47.24,58.77 47.9,59.43 M.R4.1 | v54.15,58.8 v53.6,58.8 53.57,58.77 52.73,58.77 52.08,59.42 M.R4.2 | BLK1.P7.2_SYNC1 63.49,70.55 64.94,69.1 64.94,61.64 v62.5,59.2 v62.1,58.8
  Bottom 0.254: v54.15,58.8 v62.1,58.8
SYNC2  (via drill 0.3)  (2 unrouted)
  Top 0.254: U$2.P$49 11.85,45 11.85,54.42 12.59,55.16 13.65,55.16 19.14,60.65 39.84,60.65 42.18,58.31 44.24,58.31 44.81,57.74 M.R3.1 | 52.2,57.81 52.2,57.8 v52.25,57.75 M.R3.2 | v59.7,57.75 64.49,62.54 64.49,68.65 63.09,70.05 BLK1.PJ.3_SYNC2
  Bottom 0.254: v52.25,57.75 v52.8,57.75 v59.7,57.75
  other vias: 60.25,57.75
VDD  (1 unrouted)
  Top 0.254: U1.P$3 | L.CIN1.2 16.84,81.94 | U4.P$1 | U$2.P$33 U$2.P$34 9.31,34.84 4.97,34.84 4.61,34.85
  Top 0.508: U1.P$1 | 10.05,79.61 8.74,78.3 4.35,78.3 3.19,77.14 3.19,74.9 3.19,36.27 4.61,34.85 | 13.25,81.19 L.CIN1.2
  Top 0.61: U1.P$3 18.2,83.3 18.2,85.2 U1.P$1 | 16.84,81.94 U1.P$3 | U4.P$1 11.34,81.19 13.25,81.19 U4.P$3 | U4.P$1 11.11,79.61 10.05,79.61
VS
  Top 0.254: C.CIN.1 35.22,29.6 U$4.1 35.02,30.64 34.54,30.64 33.74,31.65 31.85,31.65 31.59,31.39 C.RSHUNT.1
  Top 0.813: U$16.P$4 37.04,18.47 H.R_PULLUP.2
  Top 1.016: H.R_PULLUP.2 30.81,24.5 30.7,24.5
  pour Top (no thermals): 27.3,32.05 14.4,32.25 4.2,32.25 4.25,29.45 4.2,29.4 4.2,22.4 4.4,22.2 30.1,22.2 34.1,26.2 34.1,29.7 33.9,29.9 29.4,29.9 29.2,30.1
VTEMP  (via drill 0.3, 0.35)
  Top 0.254: 53.3,62.05 v53,62.05 | 53.3,62.05 v53.7,62.05 | M.R2.2 53.35,62.1 53.3,62.05 | U$8.2 69.95,63.65 68.3,62 v68.25,62.05
  Bottom 0.254: v68.25,62.05 v67.7,62.05 v53.7,62.05

### Text on the board
tSilk: Gate Control / 2 | Battery Balancer / Enable Logic | Connects / Before / Switch | INA219 | Gate Control / 1 | Connects / After / Switch | Battery Balancer | SHUNT | Coulomb Counter | Heater Switch
_bsilk: Heater Switch / Enable | Battery Ballancer / Enable | REMOVE BEFORE / FLIGHT | Disconnect | MSP Control | SCL | SDA | Auto | Battery Ballancer | SNIFFERS | INA219 | Coulomb Counter | SNIFFERS | SDA | SCL